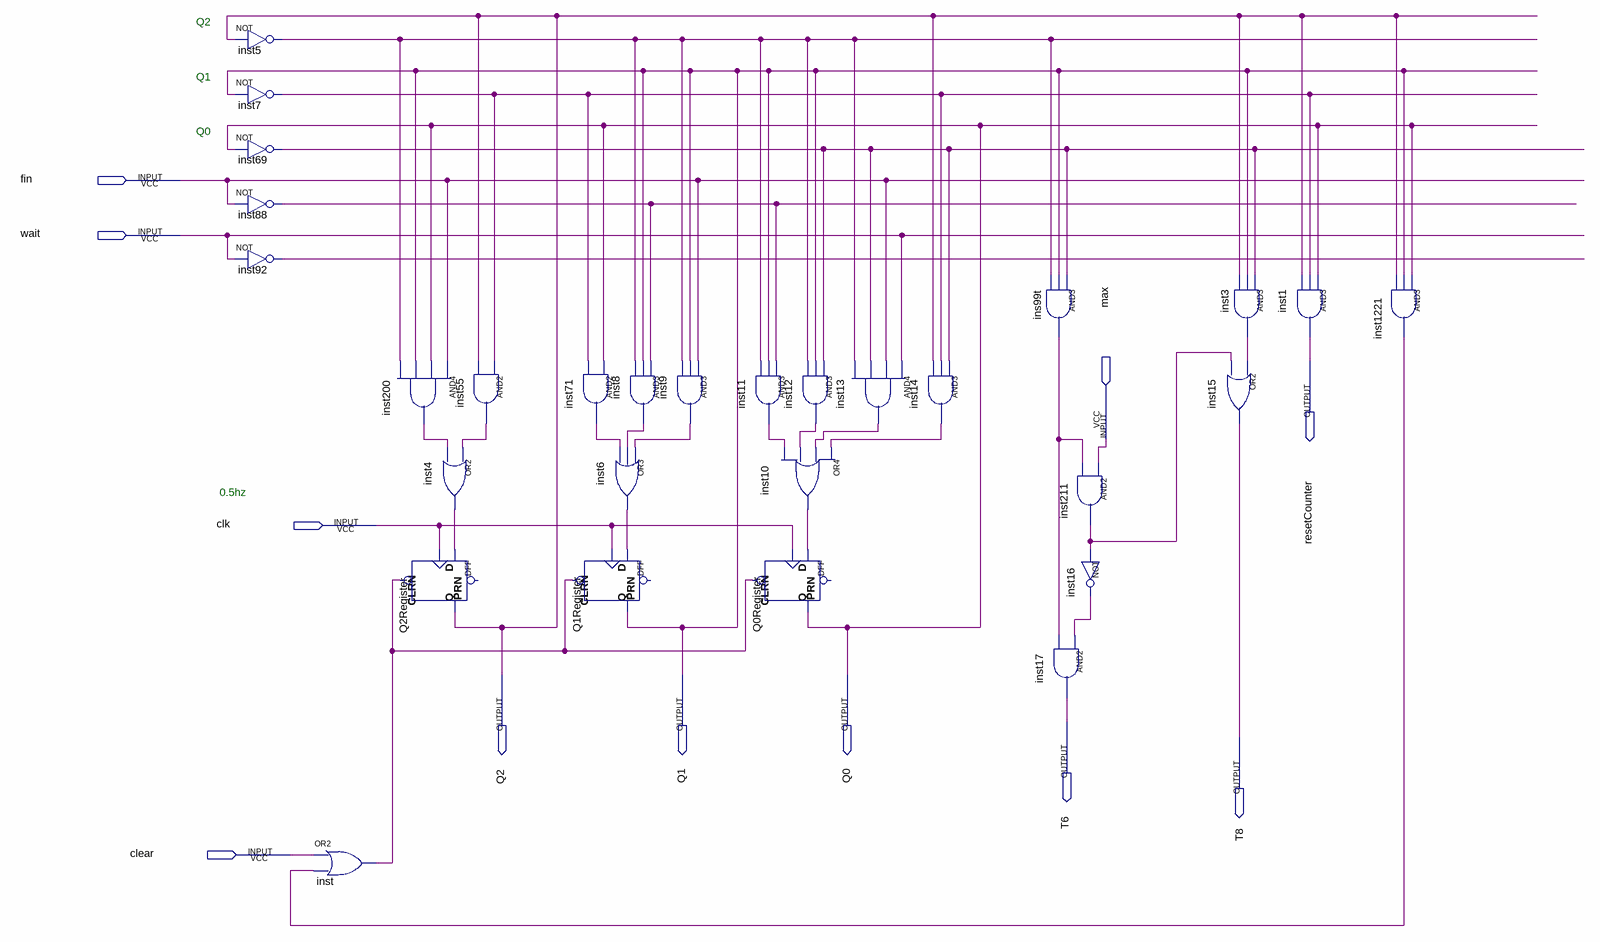
[diagram p0: schematic sheet]
// Quartus schematic TLC.bdf as structural Verilog: 29 symbols, 11 pins
module TLC (
  input  fin,
  input  \wait ,
  input  max,
  input  clk,
  input  clear,
  output resetCounter,
  output Q2,
  output Q1,
  output Q0,
  output T6,
  output T8
);

  wire ins99t_out, inst3_out, inst4_out, inst5_out, inst6_out, inst7_out, inst8_out, inst9_out, inst10_out,
       inst11_out, inst12_out, inst13_out, inst14_out, inst16_out, inst55_out, inst69_out, inst71_out,
       inst88_out, inst92_out, inst200_out, inst211_out, inst1221_out, inst_out;

  not inst5 (inst5_out, Q2);
  not inst7 (inst7_out, Q1);
  not inst69 (inst69_out, Q0);
  not inst88 (inst88_out, fin);
  not inst92 (inst92_out, \wait );
  or inst (inst_out, clear, inst1221_out);
  and inst200 (inst200_out, fin, Q0, Q1, inst5_out);
  DFF Q2Register (.CLRN(inst_out), .CLK(clk), .D(inst4_out), .Q(Q2));  // open: PRN
  and inst55 (inst55_out, inst7_out, Q2);
  or inst4 (inst4_out, inst55_out, inst200_out);
  and inst71 (inst71_out, Q0, inst7_out);
  or inst6 (inst6_out, inst9_out, inst8_out, inst71_out);
  DFF Q1Register (.CLRN(inst_out), .CLK(clk), .D(inst6_out), .Q(Q1));  // open: PRN
  and inst8 (inst8_out, inst88_out, Q1, inst5_out);
  and inst9 (inst9_out, fin, Q1, inst5_out);
  and inst11 (inst11_out, inst88_out, Q1, inst5_out);
  and inst12 (inst12_out, inst69_out, Q1, inst5_out);
  or inst10 (inst10_out, inst14_out, inst13_out, inst12_out, inst11_out);
  DFF Q0Register (.CLRN(inst_out), .CLK(clk), .D(inst10_out), .Q(Q0));  // open: PRN
  and inst13 (inst13_out, \wait , fin, inst69_out, inst5_out);
  and inst14 (inst14_out, inst69_out, inst7_out, Q2);
  and ins99t (ins99t_out, inst69_out, Q1, inst5_out);
  and inst17 (T6, inst16_out, ins99t_out);
  and inst211 (inst211_out, max, ins99t_out);
  not inst16 (inst16_out, inst211_out);
  and inst3 (inst3_out, inst69_out, Q1, Q2);
  or inst15 (T8, inst3_out, inst211_out);
  and inst1 (resetCounter, Q0, inst7_out, Q2);
  and inst1221 (inst1221_out, Q0, Q1, Q2);

  // Notes on the sheet:
  //   Q2
  //   Q1
  //   Q0
  //   0.5hz
endmodule
